# EAGLE design 607_kerberos (EAGLE 8.2.2)
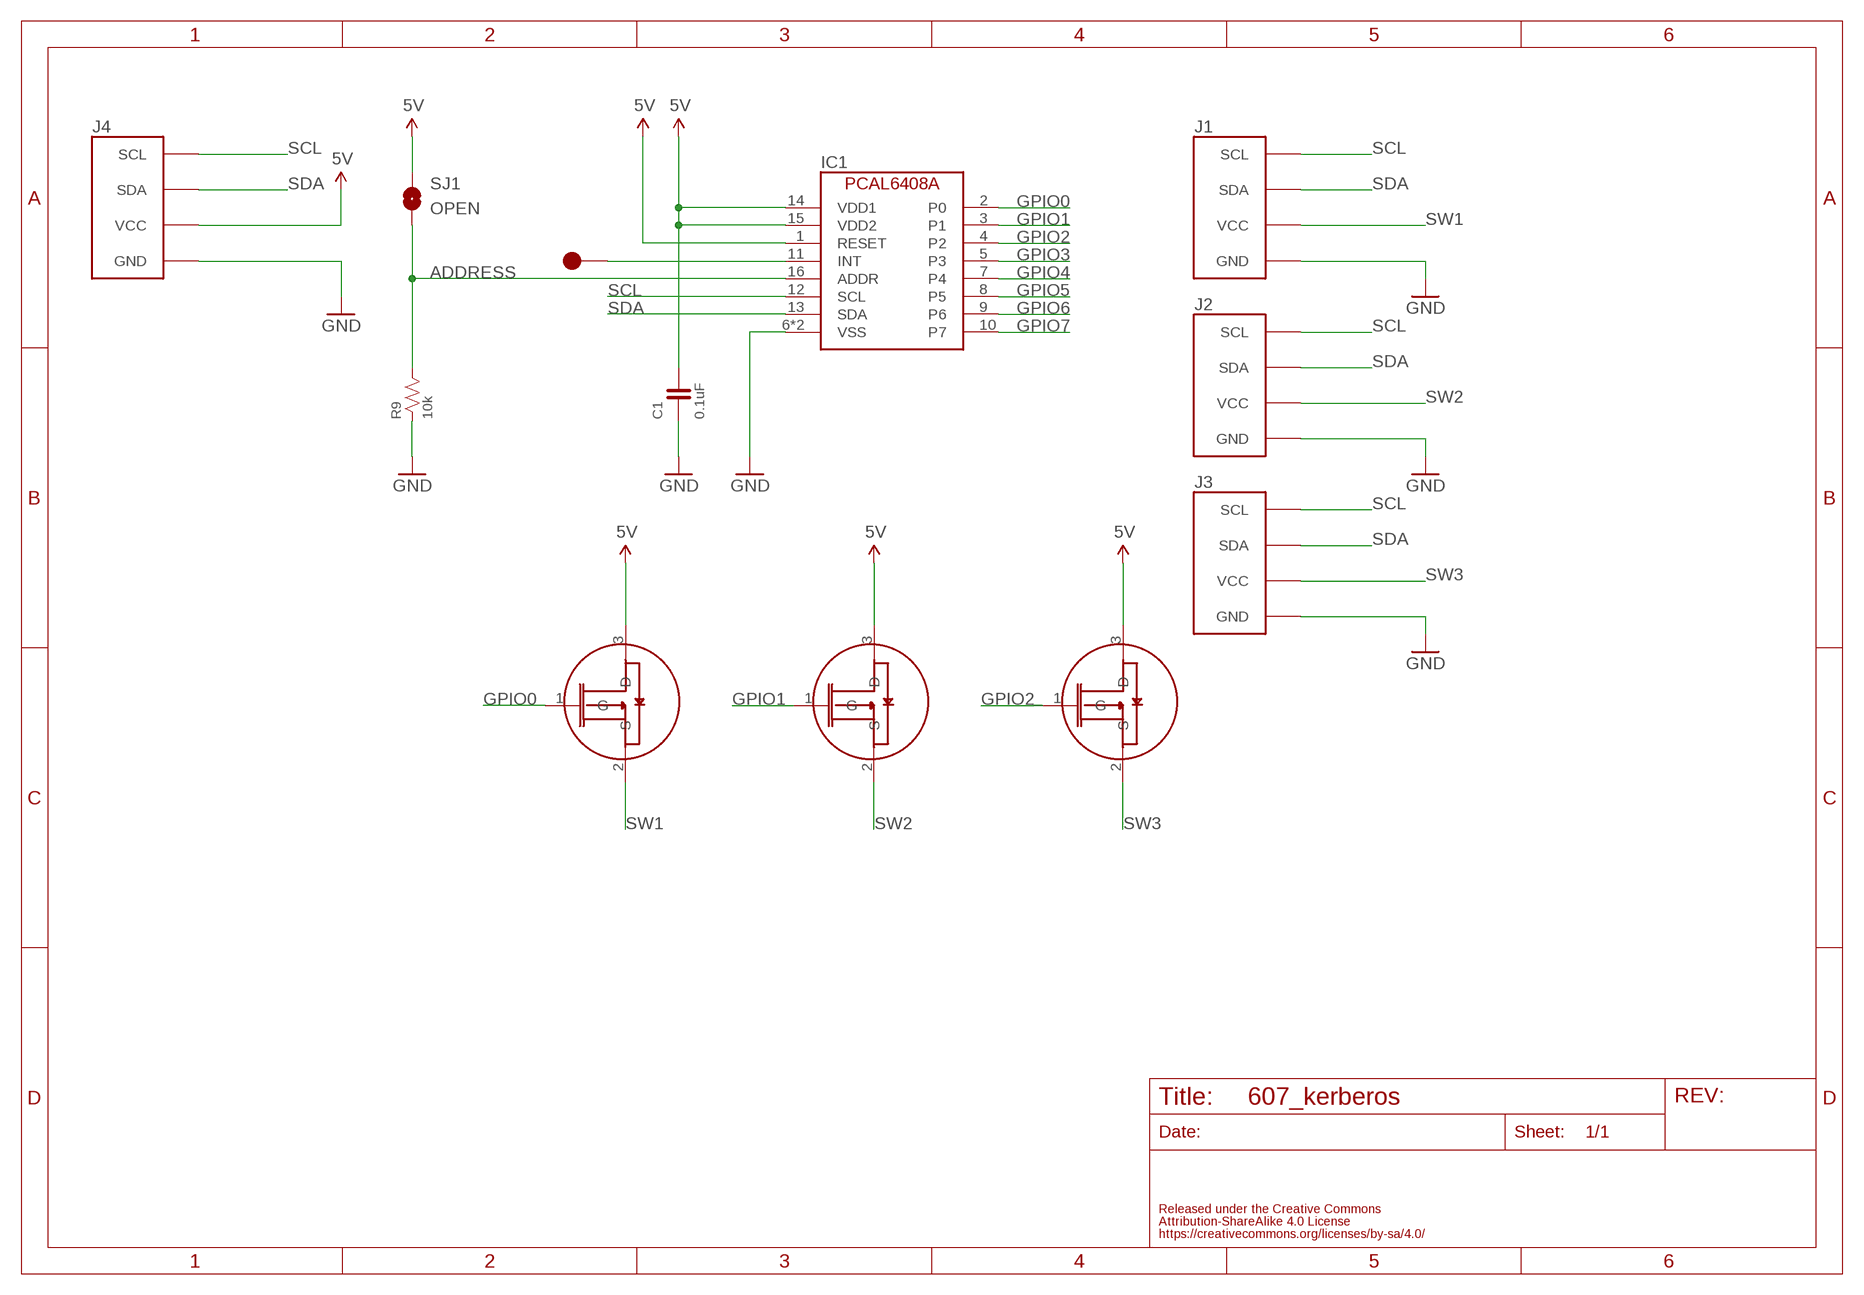
[diagram p0: schematic, sheet 1]

## Parts
C1  0.1uF  CAPACITOR-0603  [0603]
IC1  NX-PCAL6408A  [NXP-PCAL6408A]
J1  FABO_BRICK_I2C-CONNECTOR  [FABO_BRICK_I2C_CONNECTOR]
J2  FABO_BRICK_I2C-CONNECTOR  [FABO_BRICK_I2C_CONNECTOR]
J3  FABO_BRICK_I2C-CONNECTOR  [FABO_BRICK_I2C_CONNECTOR]
J4  FABO_BRICK_I2C-CONNECTOR  [FABO_BRICK_I2C_CONNECTOR]
R9  10k  RESISTOR-0603-NARROW  [0603-NARROW]
SJ1  OPEN  SMD-JUMPER-2-OPEN  [SMD-JUMPER-2-OPEN]
SW1  FAIRCHILD-FDN338  [SOT23]
SW2  FAIRCHILD-FDN338  [SOT23]
SW3  FAIRCHILD-FDN338  [SOT23]
TP1  TP-15  [TP-15]

## Nets
5V: C1.2 IC1.1(RESET) IC1.14(VDD1) IC1.15(VDD2) J4.VCC SJ1.1 SW1.3(D) SW2.3(D) SW3.3(D)
ADDRESS: IC1.16(ADDR) R9.2 SJ1.2
GND: C1.1 IC1.6(VSS) IC1.17(VSS) J1.GND J3.GND J4.GND R9.1
GPIO0: IC1.2(P0) SW1.1(G)
GPIO1: IC1.3(P1) SW2.1(G)
GPIO2: IC1.4(P2) SW3.1(G)
GPIO3: IC1.5(P3)
GPIO4: IC1.7(P4)
GPIO5: IC1.8(P5)
GPIO6: IC1.9(P6)
GPIO7: IC1.10(P7)
INT: IC1.11(INT) TP1.1
N$4: J2.GND ; supply symbol labelled GND
SCL: IC1.12(SCL) J1.SCL J2.SCL J3.SCL J4.SCL
SDA: IC1.13(SDA) J1.SDA J2.SDA J3.SDA J4.SDA
SW1: J1.VCC SW1.2(S)
SW2: J2.VCC SW2.2(S)
SW3: J3.VCC SW3.2(S)

## Library data of the parts
C1 = FaBo-Capacitor:CAPACITOR: CAPACITOR
IC1 = FaBo-Mems:NX-PCAL6408A: NXP PCAL6408A
J1-J4 = FaBo-Template:FABO_BRICK_I2C: FaBo Brick I2C
R9 = FaBo-Resistors:RESISTOR: RESISTOR
SJ1 = FaBo-Supply:SMD-JUMPER-2
SW1-SW3 = FaBo-Parts:FAIRCHILD-FDN338
TP1 = FaBo-Supply:TP

## Board
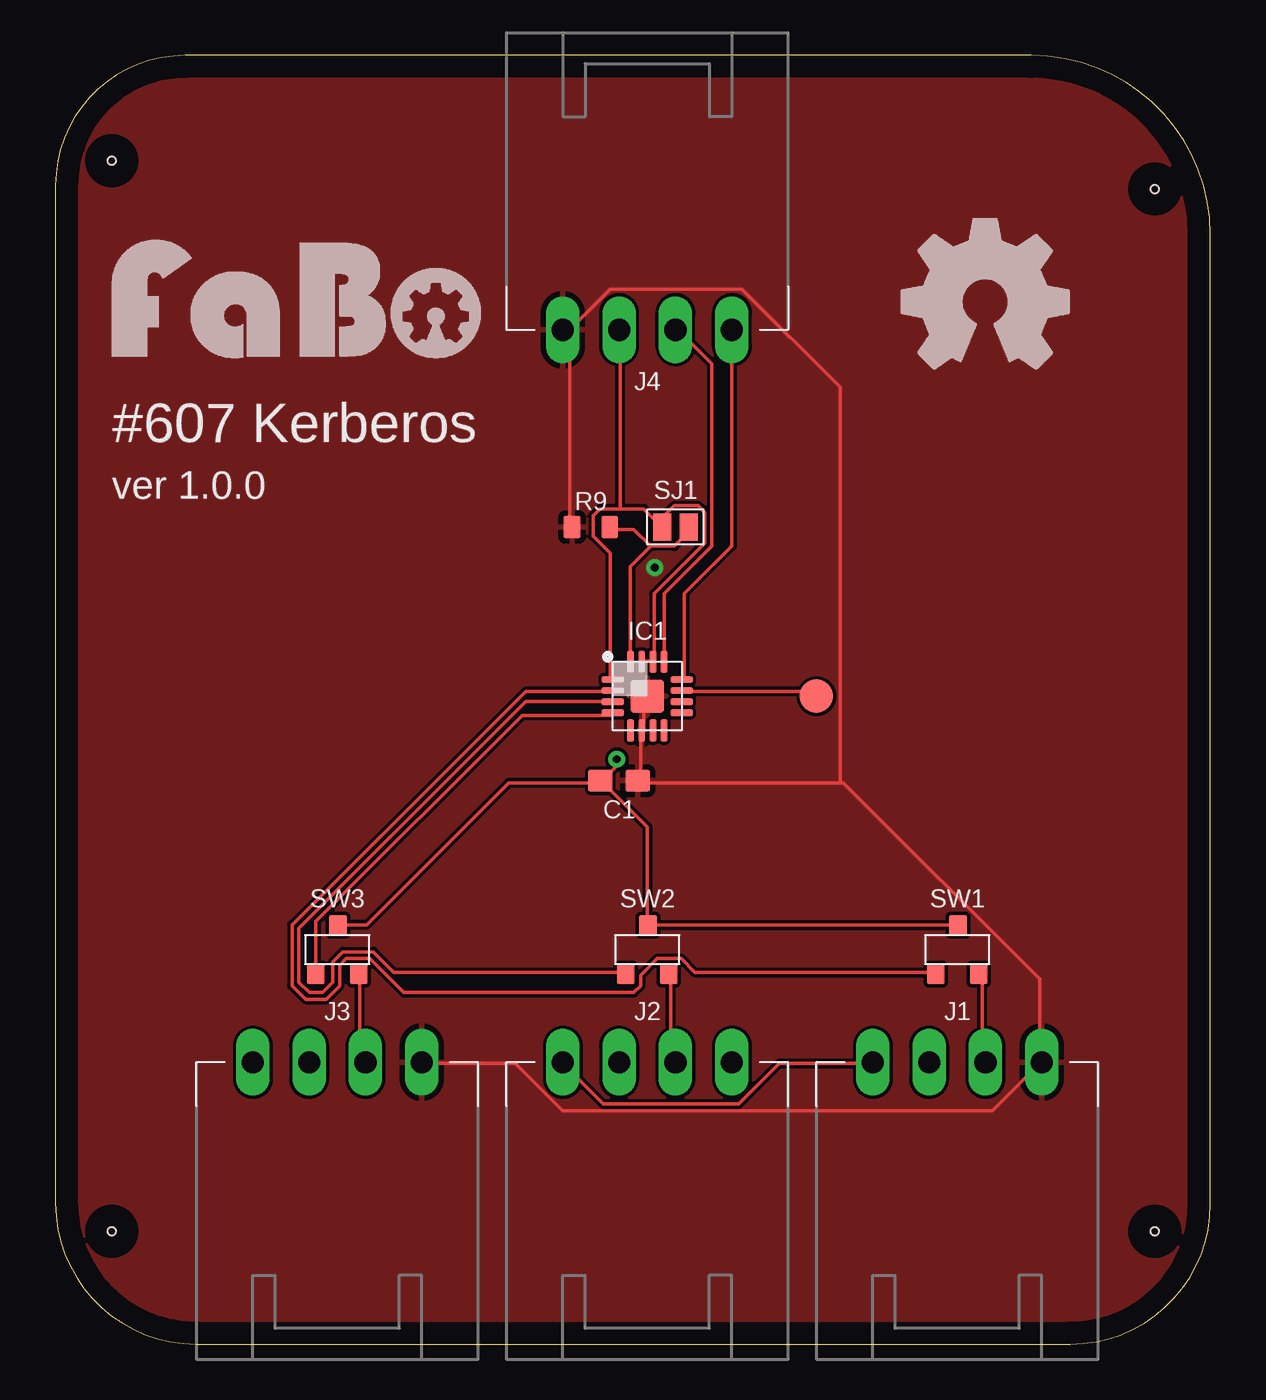
[diagram p1: board, top side]
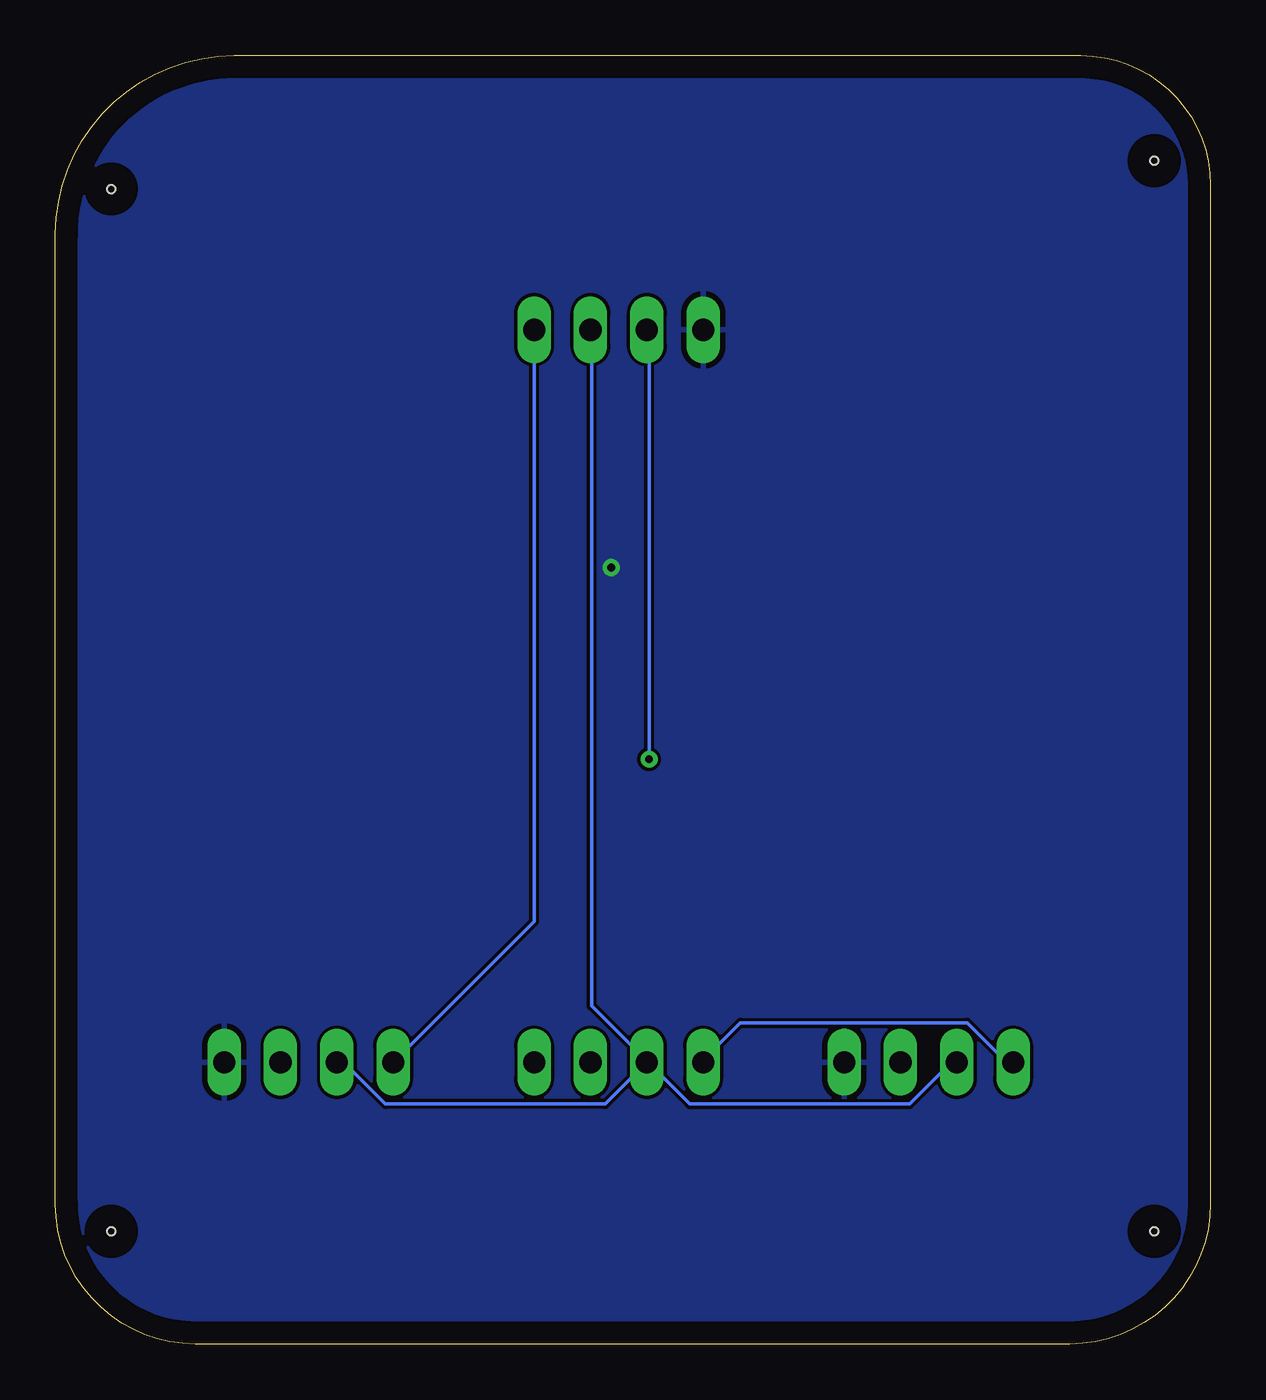
[diagram p2: board, bottom side, seen from below]

Size 52.05 x 58.09 mm. Coordinates in mm from the lower left corner, seen from the top.
Outline: 0,52.24 0,6.35 arc90 6.35,0 45.74,0 arc90 52.05,6.31 52.05,50.02 arc90 43.98,58.09 5.85,58.09 arc90 0,52.24
Copper layers (1*16): Top 0.035mm / dielectric 1.5mm / Bottom 0.035mm
Design rules "default": minimum track width 6mil, minimum drill 0.35mm, track to track 6mil, track to pad 6mil, pad to pad 6mil, via to via 6mil, smd to smd 6mil, copper to edge 40mil, drill to drill 6mil, minimum pad ring 10mil, minimum via ring 8mil, stop-mask expansion 4mil, vias tented up to drill 0mil, thermal gap 10mil
Holes 0.35 mm at 2.54,53.34 49.53,52.07 49.53,5.08 2.54,5.08

### Footprints (pad centres in the part's own frame; a part is rotated, then mirrored left to right if it is on the bottom)
0603 = smd 1.1 x 1: 1 -0.85,0; 2 0.85,0
NXP-PCAL6408A = smd 1 x 0.3: 1 -1.55,0.75; 2 -1.55,0.25; 3 -1.55,-0.25; 4 -1.55,-0.75; 9 1.55,-0.75; 10 1.55,-0.25; 11 1.55,0.25; 12 1.55,0.75 | smd 0.3 x 1: 5 -0.75,-1.55; 6 -0.25,-1.55; 7 0.25,-1.55; 8 0.75,-1.55; 13 0.75,1.55; 14 0.25,1.55; 15 -0.25,1.55; 16 -0.75,1.55 | smd 1.5 x 1.5: 17 0,0
FABO_BRICK_I2C_CONNECTOR = drill 1 long: GND -3.81,0; SCL 3.81,0; SDA 1.27,0; VCC -1.27,0
0603-NARROW = smd 0.75 x 1: 1 -0.85,0; 2 0.85,0
SMD-JUMPER-2-OPEN = smd 0.8 x 1.2: 1 -0.6,0; 2 0.6,0
SOT23 = smd 0.8 x 0.9: 1 -0.97,-1.1; 2 0.97,-1.1; 3 0.03,1.1
TP-15 = smd 1.5 x 1.5: 1 0,0

### Placement (x,y rotation side)
C1  25.4,25.4 180 top
IC1  26.67,29.21 0 top
J1  40.64,12.7 180 top
J2  26.67,12.7 180 top
J3  12.7,12.7 180 top
J4  26.67,45.72 0 top
R9  24.13,36.83 0 top
SJ1  27.94,36.83 0 top
SW1  40.64,17.78 0 top
SW2  26.67,17.78 0 top
SW3  12.7,17.78 0 top
TP1  34.29,29.21 0 top
U$2  [LOGO_FABO_L]  10.16,44.45 0 top
U$3  [LOGO_OSHW_L]  41.91,46.99 0 top

### Tracks (layer width: path | path; a pad name or v marks a point on that pad's centre or on a via)
5V  (via drill 0.35)
  Top 0.152: IC1.15 26.52,30.79 26.82,30.79 IC1.14 26.98,30.79 26.98,33.83 29.26,36.12 29.26,37.49 28.96,37.8 27.89,37.8 27.13,37.03 | 25.45,37.64 26.52,37.64 27.13,37.03 | 25.45,37.64 24.54,37.64 24.23,37.34 24.23,36.42 24.99,35.66 24.99,30.02 IC1.1 | 27.13,37.03 27.28,36.88 SJ1.1 27.13,37.03 | 25.45,37.64 25.45,45.72 J4.VCC | SW3.3 12.8,18.9 14.02,18.9 20.42,25.3 24.54,25.3 C1.2 | C1.2 24.69,25.3 26.67,23.32 26.67,18.9 SW2.3 26.82,18.9 40.54,18.9 SW1.3 | v25.3,26.36 25.3,26.06 24.69,25.45 C1.2
  Bottom 0.152: v25.3,26.36 25.3,45.72 J4.VCC
ADDRESS
  Top 0.152: 26.82,35.97 26.06,36.73 24.99,36.73 R9.2 | 26.82,35.97 27.89,35.97 28.65,36.73 SJ1.2 | 26.82,35.97 25.91,35.05 25.91,30.79 IC1.16
GND  (via drill 0.35)
  Top 0.152: 23.01,45.57 23.16,45.41 23.16,36.88 R9.1 | IC1.17 26.67,29.11 26.52,28.96 26.52,27.74 IC1.6 26.36,27.58 26.36,25.45 C1.1 26.36,25.3 35.36,25.3 | 35.36,25.3 35.51,25.3 44.35,16.46 44.35,12.8 J1.GND 44.35,12.65 42.22,10.52 22.86,10.52 20.73,12.65 16.61,12.65 J3.GND | 23.01,45.57 24.99,47.55 30.94,47.55 35.36,43.13 35.36,25.3 | 23.01,45.57 J4.GND
  other vias: 27,35
  pour Bottom: 0,0 52.07,0 52.07,58.42 0,58.42
  pour Top: 0,0 52.07,0 52.07,58.42 0,58.42
GPIO0
  Top 0.152: SW1.1 39.62,16.76 28.8,16.76 28.19,17.37 27.13,17.37 26.36,16.61 26.36,16.15 26.06,15.85 15.7,15.85 14.17,17.37 13.11,17.37 12.8,17.07 12.8,16.15 12.19,15.54 11.28,15.54 10.67,16.15 10.67,18.9 21.18,29.41 24.99,29.41 IC1.2
GPIO1
  Top 0.152: SW2.1 25.6,16.76 15.24,16.76 14.33,17.68 12.95,17.68 12.5,17.22 12.5,16.31 12.04,15.85 11.43,15.85 10.97,16.31 10.97,18.75 21.18,28.96 24.99,28.96 IC1.3
GPIO2
  Top 0.152: SW3.1 11.73,16.76 11.73,19.05 21.03,28.35 24.99,28.35 IC1.4
INT
  Top 0.152: IC1.11 28.35,29.41 34.14,29.41 34.29,29.26 TP1.1
SCL
  Top 0.152: J4.SCL 30.48,35.97 28.35,33.83 28.35,30.02 IC1.12 | J1.SCL 36.73,12.65 32.61,12.65 30.79,10.82 24.69,10.82 22.86,12.65 J2.SCL
  Bottom 0.152: J3.SCL 8.99,12.8 9.3,12.8 10.97,14.48 21.18,14.48 22.86,12.8 J2.SCL | J4.SCL 30.48,19.05 J1.SCL
SDA
  Top 0.152: IC1.13 27.43,30.79 27.43,33.83 29.57,35.97 29.57,44.2 28.04,45.72 J4.SDA
  Bottom 0.152: J3.SDA 11.43,12.65 11.73,12.65 13.56,10.82 23.47,10.82 25.3,12.65 J2.SDA | J2.SDA 27.28,10.82 37.19,10.82 39.01,12.65 39.32,12.65 J1.SDA | J4.SDA 27.89,45.72 27.89,15.24 25.45,12.8 J2.SDA
SW1
  Top 0.152: SW1.2 41.76,16.61 41.76,12.95 41.91,12.8 J1.VCC
SW2
  Top 0.152: SW2.2 27.74,16.61 27.74,12.95 27.89,12.8 J2.VCC
SW3
  Top 0.152: J3.VCC 13.72,12.95 13.72,16.61 SW3.2

### Text on the board
tPlace: #607 Kerberos | ver 1.0.0